# EAGLE design RF-VtoI (EAGLE 9.0.1)
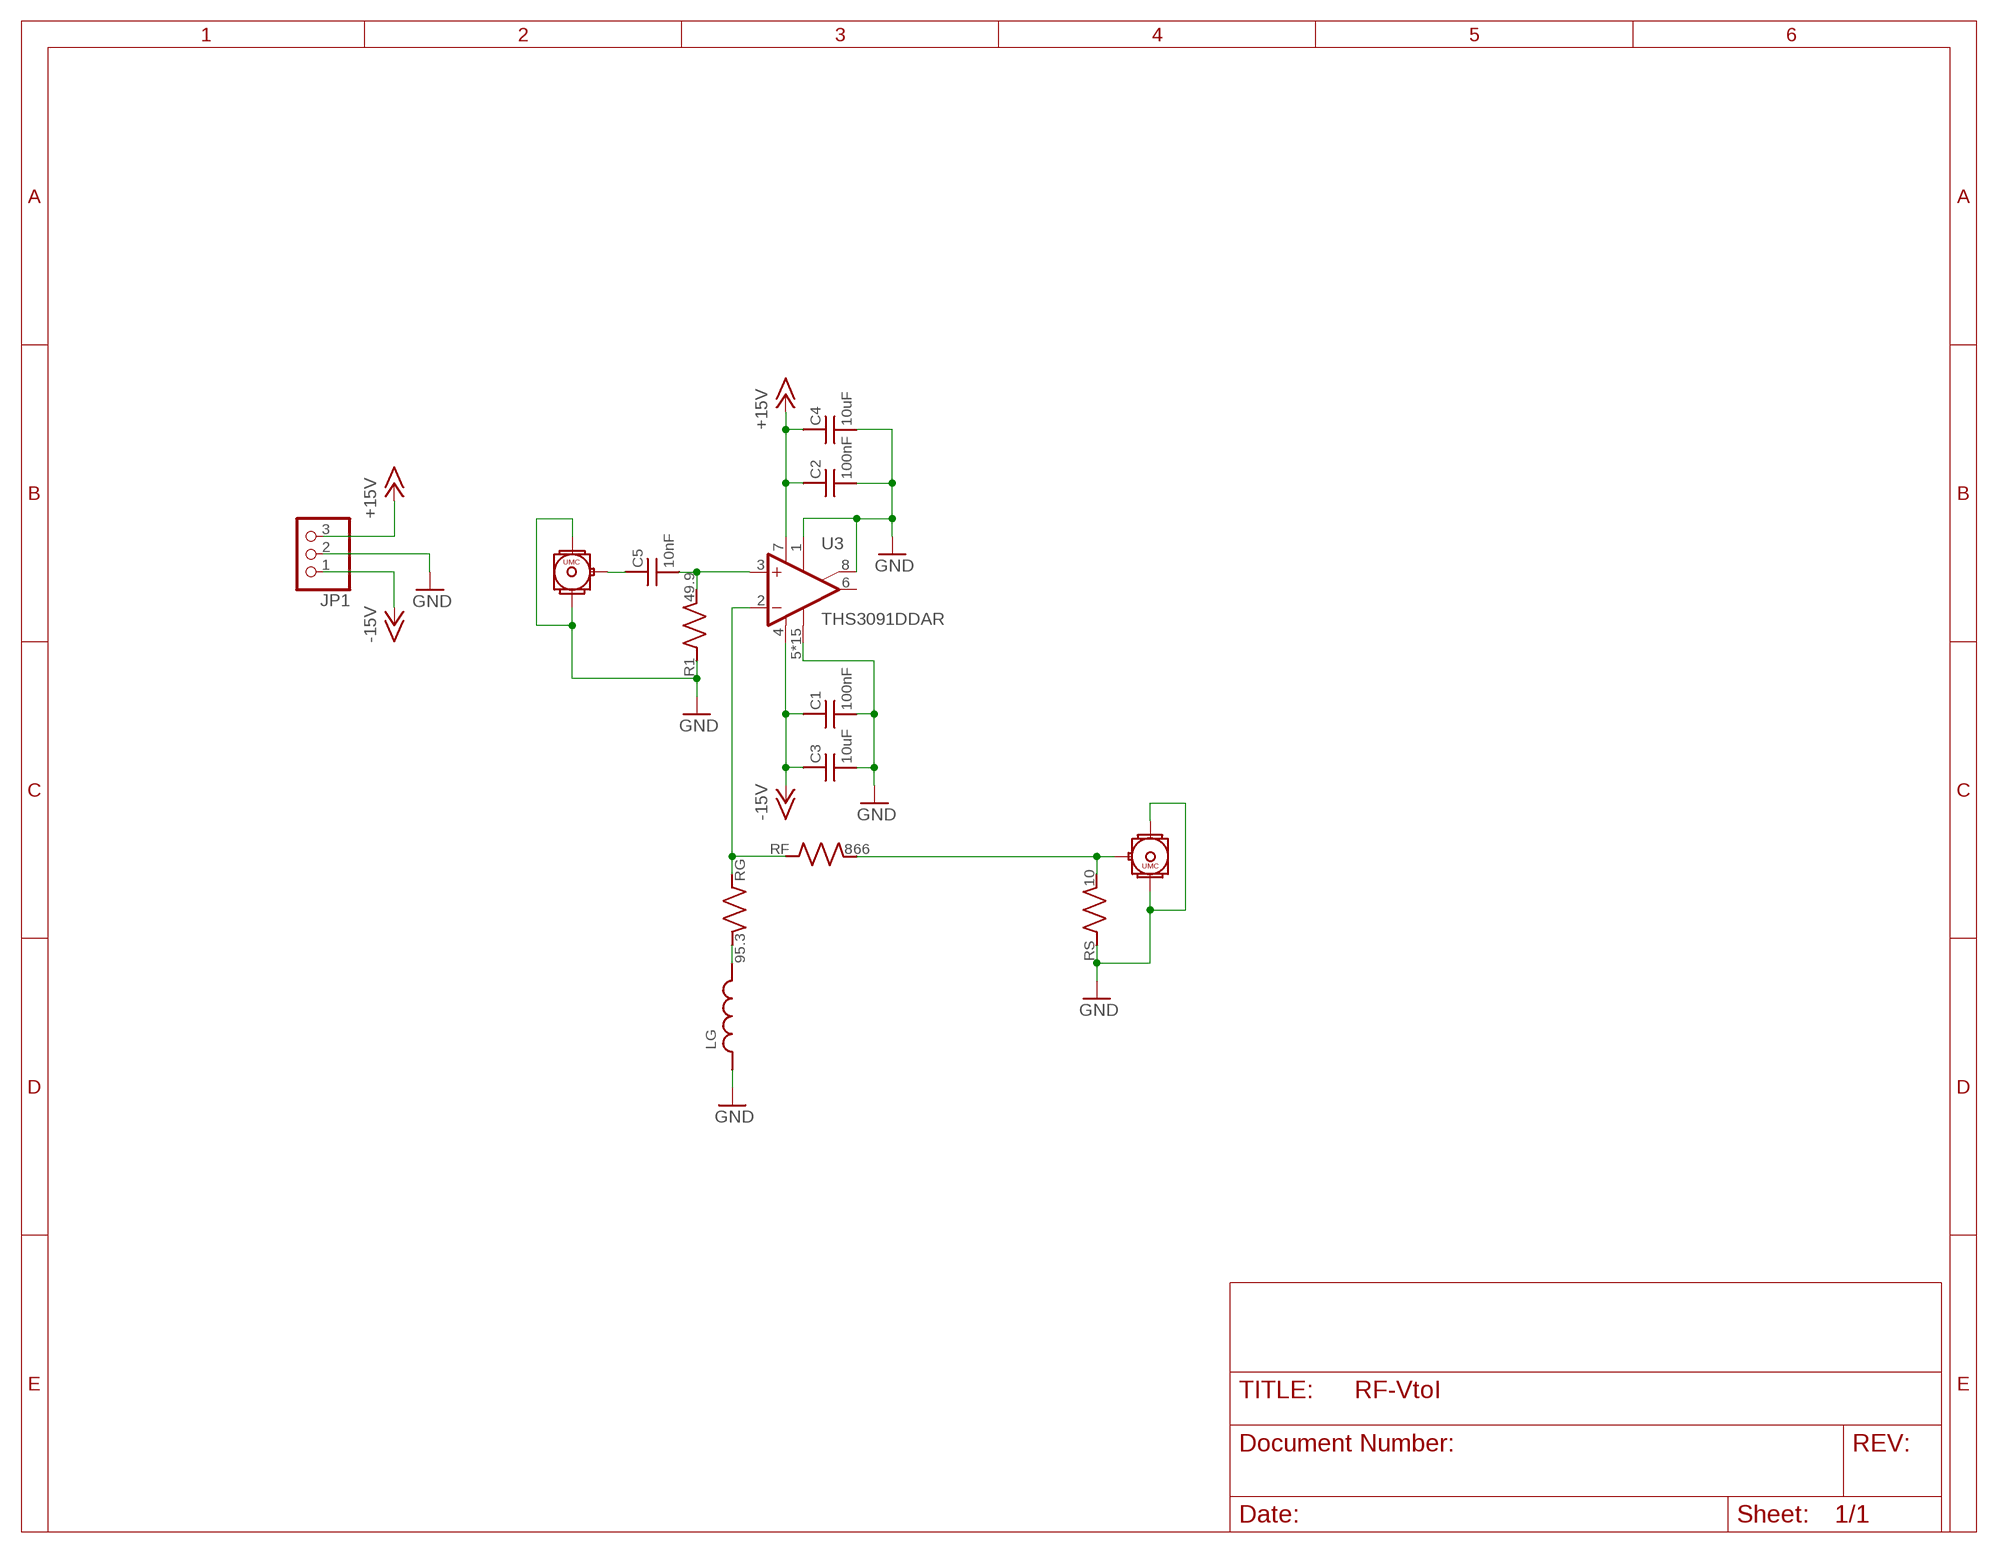
[diagram p0: schematic, sheet 1]

## Parts
C1  100nF  C_MLCC_SMDCMLCC_0603  [C_MLCC_0603]
C2  100nF  C_MLCC_SMDCMLCC_0603  [C_MLCC_0603]
C3  10uF  C_MLCC_SMDCMLCC_1206  [C_MLCC_1206]
C4  10uF  C_MLCC_SMDCMLCC_1206  [C_MLCC_1206]
C5  10nF  C_MLCC_SMDCMLCC_0402  [C_MLCC_0402]
CON1  UMC_CONNECTORREGULAR  [UMC_CONNECTOR]
CON2  UMC_CONNECTORREGULAR  [UMC_CONNECTOR]
JP1  PINHD-1X3  [1X03]
LG  L_FERRITE_SMD_1008  [1008]
R1  49.9  R_SMDR0402  [R_0402]
RF  866  R_SMDR0603  [R_0603]
RG  95.3  R_SMDR0402  [R_0402]
RS  10  R_SMDR1206  [R_1206]
U3  THS3091DDAR  [DDA8_2P28X2P28]

## Nets
+15V: C2.P$1 C4.P$1 JP1.3 U3.7(V+)
-15V: C1.P$1 C3.P$1 JP1.1 U3.4(V-)
GND: C1.P$2 C2.P$2 C3.P$2 C4.P$2 CON1.P$2 CON1.P$3 CON2.P$2 CON2.P$3 JP1.2 LG.P$1 R1.P$1 RS.P$1 U3.1(ON1) U3.5(OPT) U3.8(ON2) U3.EPAD(OPT) U3.P$1(OPT) U3.P$2(OPT) U3.P$3(OPT) U3.P$4(OPT) U3.P$5(OPT) U3.P$6(OPT) U3.P$7(OPT) U3.P$8(OPT) U3.P$9(OPT) U3.P$10(OPT) U3.P$11(OPT) U3.P$12(OPT) U3.P$13(OPT)
N$1: RF.P$1 RG.P$1 U3.2(-IN)
N$2: CON1.P$1 RF.P$2 RS.P$2
N$3: C5.P$2 R1.P$2 U3.3(+IN)
N$4: C5.P$1 CON2.P$1
N$6: LG.P$2 RG.P$2
Unconnected: U3.6(OUT)

## Library data of the parts
C1 C2 = jqi_passives:C_MLCC_SMD; PARTNO: 06035C104K4Z2A
C3 C4 = jqi_passives:C_MLCC_SMD; PARTNO: C3216X5R1H106K160AB
C5 = jqi_passives:C_MLCC_SMD; PARTNO: CL05B103KB5NNNC
CON1 CON2 = qkdlab_alessandro:UMC_CONNECTOR; PARTNO: 1909763-1
JP1 = pinhead:PINHD-1X3: PIN HEADER; PARTNO: 640456-3
LG = jqi_passives:L_FERRITE_SMD
R1 = jqi_passives:R_SMD; PARTNO: ERA-2AEB49R9X
RF = jqi_passives:R_SMD; PARTNO: ERA-3AEB8660V
RG = jqi_passives:R_SMD; PARTNO: ERA-2AEB95R3X
RS = jqi_passives:R_SMD; PARTNO: PHP01206E10R0BST5
U3 = opamp-jqi:THS3091DDAR; BUILT_BY: EMA_UL_Team; MANUFACTURER: Texas Instruments; MANUFACTURER_PART_NUMBER: THS3091DDAR; PARTNO: THS3091DDAR; VENDOR: Texas Instruments

## Board
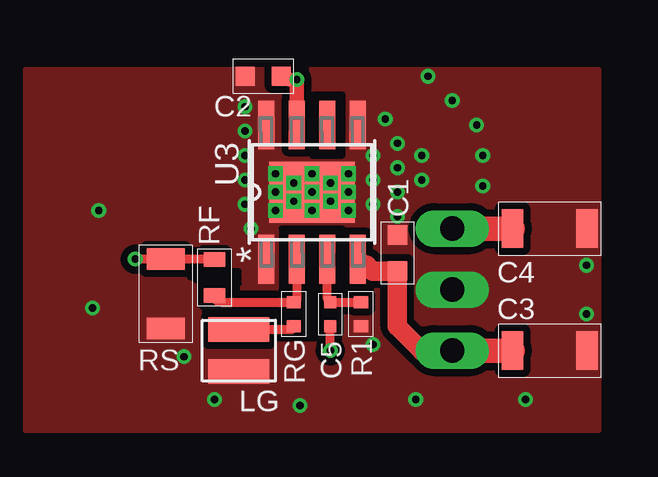
[diagram p1: board, top side]
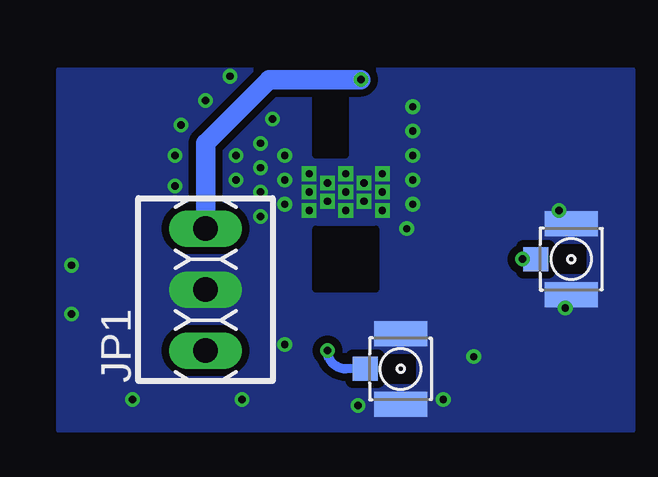
[diagram p2: board, bottom side, seen from below]

No outline drawn. Coordinates in mm, seen from the top.
Copper layers (1*16): Top 0.035mm / dielectric 1.5mm / Bottom 0.035mm
Design rules "MF_Standard_2_Layer *": minimum track width 5mil, minimum drill 12mil, track to track 5mil, track to pad 5mil, pad to pad 5mil, via to via 5mil, smd to smd 0mil, copper to edge 5mil, drill to drill 10mil, minimum pad ring 6mil, minimum via ring 6mil, stop-mask expansion 2mil, vias tented up to drill 25mil, thermal gap 10mil
bKeepout: area 0,0 to 23.9,11.4

### Footprints (pad centres in the part's own frame; a part is rotated, then mirrored left to right if it is on the bottom)
C_MLCC_0603 = smd 0.8 x 0.8: P$1 -0.75,0; P$2 0.75,0
C_MLCC_1206 = smd 0.9 x 1.6: P$1 -1.55,0; P$2 1.55,0
C_MLCC_0402 = smd 0.5 x 0.5: P$1 -0.5,0; P$2 0.5,0
UMC_CONNECTOR = smd 1.041 x 0.991: P$1 1.473,0 | smd 2.21 x 1.041: P$2 0,1.473; P$3 0,-1.473
1X03 = drill 1.016 long: 1 -2.54,0; 2 0,0; 3 2.54,0
1008 = smd 2.54 x 1.016: P$1 0,-0.876; P$2 0,0.876
R_0402 = smd 0.5 x 0.6: P$1 -0.5,0; P$2 0.5,0
R_0603 = smd 0.6 x 0.9: P$1 -0.75,0; P$2 0.75,0
R_1206 = smd 0.9 x 1.6: P$1 -1.45,0; P$2 1.45,0
DDA8_2P28X2P28 = smd 2.032 x 0.66: 1 -2.794,1.905; 2 -2.794,0.635; 3 -2.794,-0.635; 4 -2.794,-1.905; 5 2.794,-1.905; 6 2.794,-0.635; 7 2.794,0.635; 8 2.794,1.905 | smd 2.54 x 3.556: EPAD 0,0 | drill 0.305 square: P$1 0,0; P$2 -0.762,0; P$3 0.762,0; P$4 0.762,-1.524; P$5 0,-1.524; P$6 -0.762,-1.524; P$7 -0.762,1.524; P$8 0,1.524; P$9 0.762,1.524; P$10 0.381,0.762; P$11 -0.381,0.762; P$12 -0.381,-0.762; P$13 0.381,-0.762

### Placement (x,y rotation side)
C1  15.49,7.37 90 top
C2  9.91,14.73 180 top
C3  21.84,3.3 0 top
C4  21.84,8.38 0 top
C5  12.7,4.83 90 top
CON1  2.54,7.11 180 bottom
CON2  9.65,2.54 180 bottom
JP1  17.78,5.84 90 bottom
LG  8.89,3.3 0 top
R1  13.97,4.83 90 top
RF  7.87,6.35 90 top
RG  11.18,4.83 270 top
RS  5.84,5.66 90 top
U3  11.94,9.91 90 top

### Tracks (layer width: path | path; a pad name or v marks a point on that pad's centre or on a via)
+15V  (via drill 0.3)
  Top 0.61: U3.7 v11.3,14.6 11.3,14.48 C2.P$1
  Top 1.016: JP1.3 C4.P$1
  Bottom 0.813: JP1.3 17.78,11.94 15.12,14.6 v11.3,14.6
-15V
  Top 0.61: 14.22,6.86 13.97,7.11 U3.4
  Top 0.813: JP1.1 16.51,3.3 15.49,4.32 C1.P$1 14.47,6.62 14.22,6.86
  Top 1.016: JP1.1 C3.P$1
GND  (via drill 0.3)
  other vias: 6.6,3.05 7.87,1.27 15.49,8.89 9.14,13.46 23.37,6.86 23.37,4.83 14.48,3.56 2.79,5.08 3.05,9.14 11.43,1.02 15.49,11.94 17.78,13.72 16.26,1.27 20.83,1.27 14.99,12.95 16.51,11.43 16.51,10.41 15.49,10.92 15.49,9.91 16.76,14.73 19.05,10.16 19.05,11.43 18.8,12.7 9.14,12.45 9.14,11.43 9.14,10.41 9.14,9.4 9.4,8.38 14.48,10.41 14.48,9.4 14.48,11.43
  pour Top (isolate 0.305, rank 6, no thermals): 0,0 23.88,0 23.88,14.99 0,14.99
  pour Bottom (isolate 0.305, rank 6, no thermals): 0,0 23.88,0 23.88,14.99 0,14.99
  cutout Bottom (isolate 0.305, rank 5): 10.67,3.05 9.14,3.05 9.14,2.03 10.67,2.03
  cutout Bottom (isolate 0.305, rank 5): 3.56,7.62 2.03,7.62 2.03,6.6 3.56,6.6
  cutout Top (isolate 0.305, rank 5): 11.43,5.84 11.43,3.81 12.45,3.81 12.45,5.84 13.21,5.84 13.21,8.38 10.67,8.38 10.67,5.84
  cutout Top (isolate 0.305, rank 5): 7.37,6.1 8.89,6.1 8.89,6.6 6.86,6.6 6.86,6.35
  cutout Bottom (isolate 0.305, rank 5): 13.21,8.38 10.67,8.38 10.67,5.84 13.21,5.84
  cutout Bottom (isolate 0.305, rank 5): 11.94,13.97 11.94,11.43 13.21,11.43 13.21,13.97
  cutout Top (isolate 0.305, rank 5): 11.94,13.97 11.94,11.43 13.21,11.43 13.21,13.97
N$1
  Top 0.381: 11.17,5.33 arc-90 RG.P$1 | RF.P$1 arc90 8.15,5.33 RG.P$1 | U3.2 11.3,5.45 arc-90 RG.P$1
N$2  (via drill 0.3)
  Top 0.381: RF.P$2 arc90 8.11,7.11 RS.P$2 arc-90 RS.P$2 v4.57,7.11
  Bottom 0.381: v4.57,7.11 CON1.P$1
N$3
  Top 0.381: C5.P$2 | C5.P$2 12.57,5.45 U3.3 | C5.P$2 R1.P$2
N$4  (via drill 0.3)
  Top 0.381: v12.7,3.3 C5.P$1
  Bottom 0.381: CON2.P$1 11.94,2.54 arc90 v12.7,3.3
N$6
  Top 0.381: RG.P$2 arc-90 11.03,4.18 LG.P$2